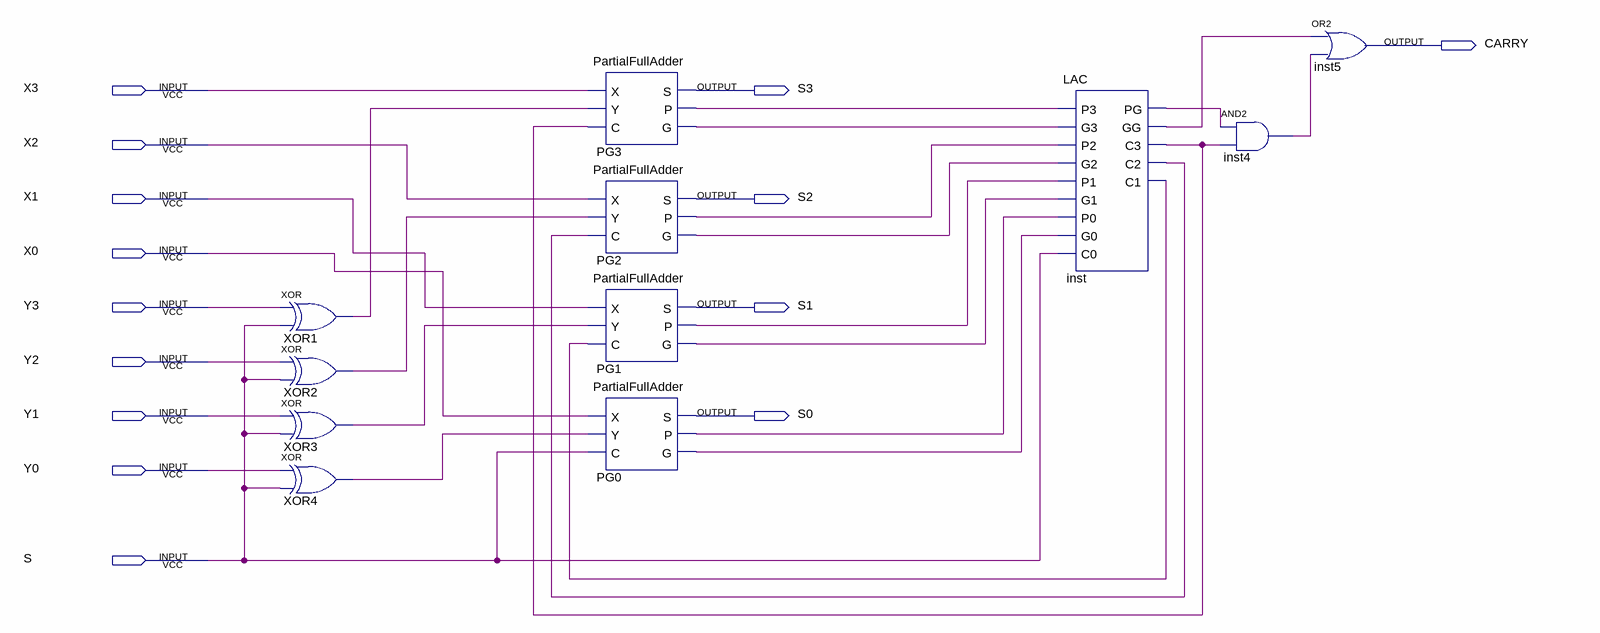
[diagram p0: schematic sheet]
// Quartus schematic 4bitCLA.bdf as structural Verilog: 11 symbols, 14 pins
module \4bitCLA  (
  input  X3,
  input  X2,
  input  X1,
  input  X0,
  input  Y3,
  input  Y2,
  input  Y1,
  input  Y0,
  input  S,
  output CARRY,
  output S3,
  output S2,
  output S1,
  output S0
);

  wire inst4_out, inst_c1, inst_c2, inst_c3, inst_gg, inst_pg, PG0_g, PG0_p, PG1_g, PG1_p, PG2_g, PG2_p,
       PG3_g, PG3_p, XOR1_out, XOR2_out, XOR3_out, XOR4_out;

  xor XOR1 (XOR1_out, Y3, S);
  xor XOR2 (XOR2_out, Y2, S);
  xor XOR3 (XOR3_out, Y1, S);
  xor XOR4 (XOR4_out, Y0, S);
  PartialFullAdder PG3 (.X(X3), .Y(XOR1_out), .C(inst_c3), .S(S3), .P(PG3_p), .G(PG3_g));
  PartialFullAdder PG2 (.X(X2), .Y(XOR2_out), .C(inst_c2), .S(S2), .P(PG2_p), .G(PG2_g));
  PartialFullAdder PG1 (.X(X1), .Y(XOR3_out), .C(inst_c1), .S(S1), .P(PG1_p), .G(PG1_g));
  PartialFullAdder PG0 (.X(X0), .Y(XOR4_out), .C(S), .S(S0), .P(PG0_p), .G(PG0_g));
  LAC inst (
    .P3(PG3_p), .G3(PG3_g), .P2(PG2_p), .G2(PG2_g), .P1(PG1_p), .G1(PG1_g), .P0(PG0_p), .G0(PG0_g), .C0(S),
    .PG(inst_pg), .GG(inst_gg), .C3(inst_c3), .C2(inst_c2), .C1(inst_c1));
  and inst4 (inst4_out, inst_pg, inst_c3);
  or inst5 (CARRY, inst_gg, inst4_out);
endmodule
